# EAGLE schematic wfipic32host (EAGLE 9.6.2)
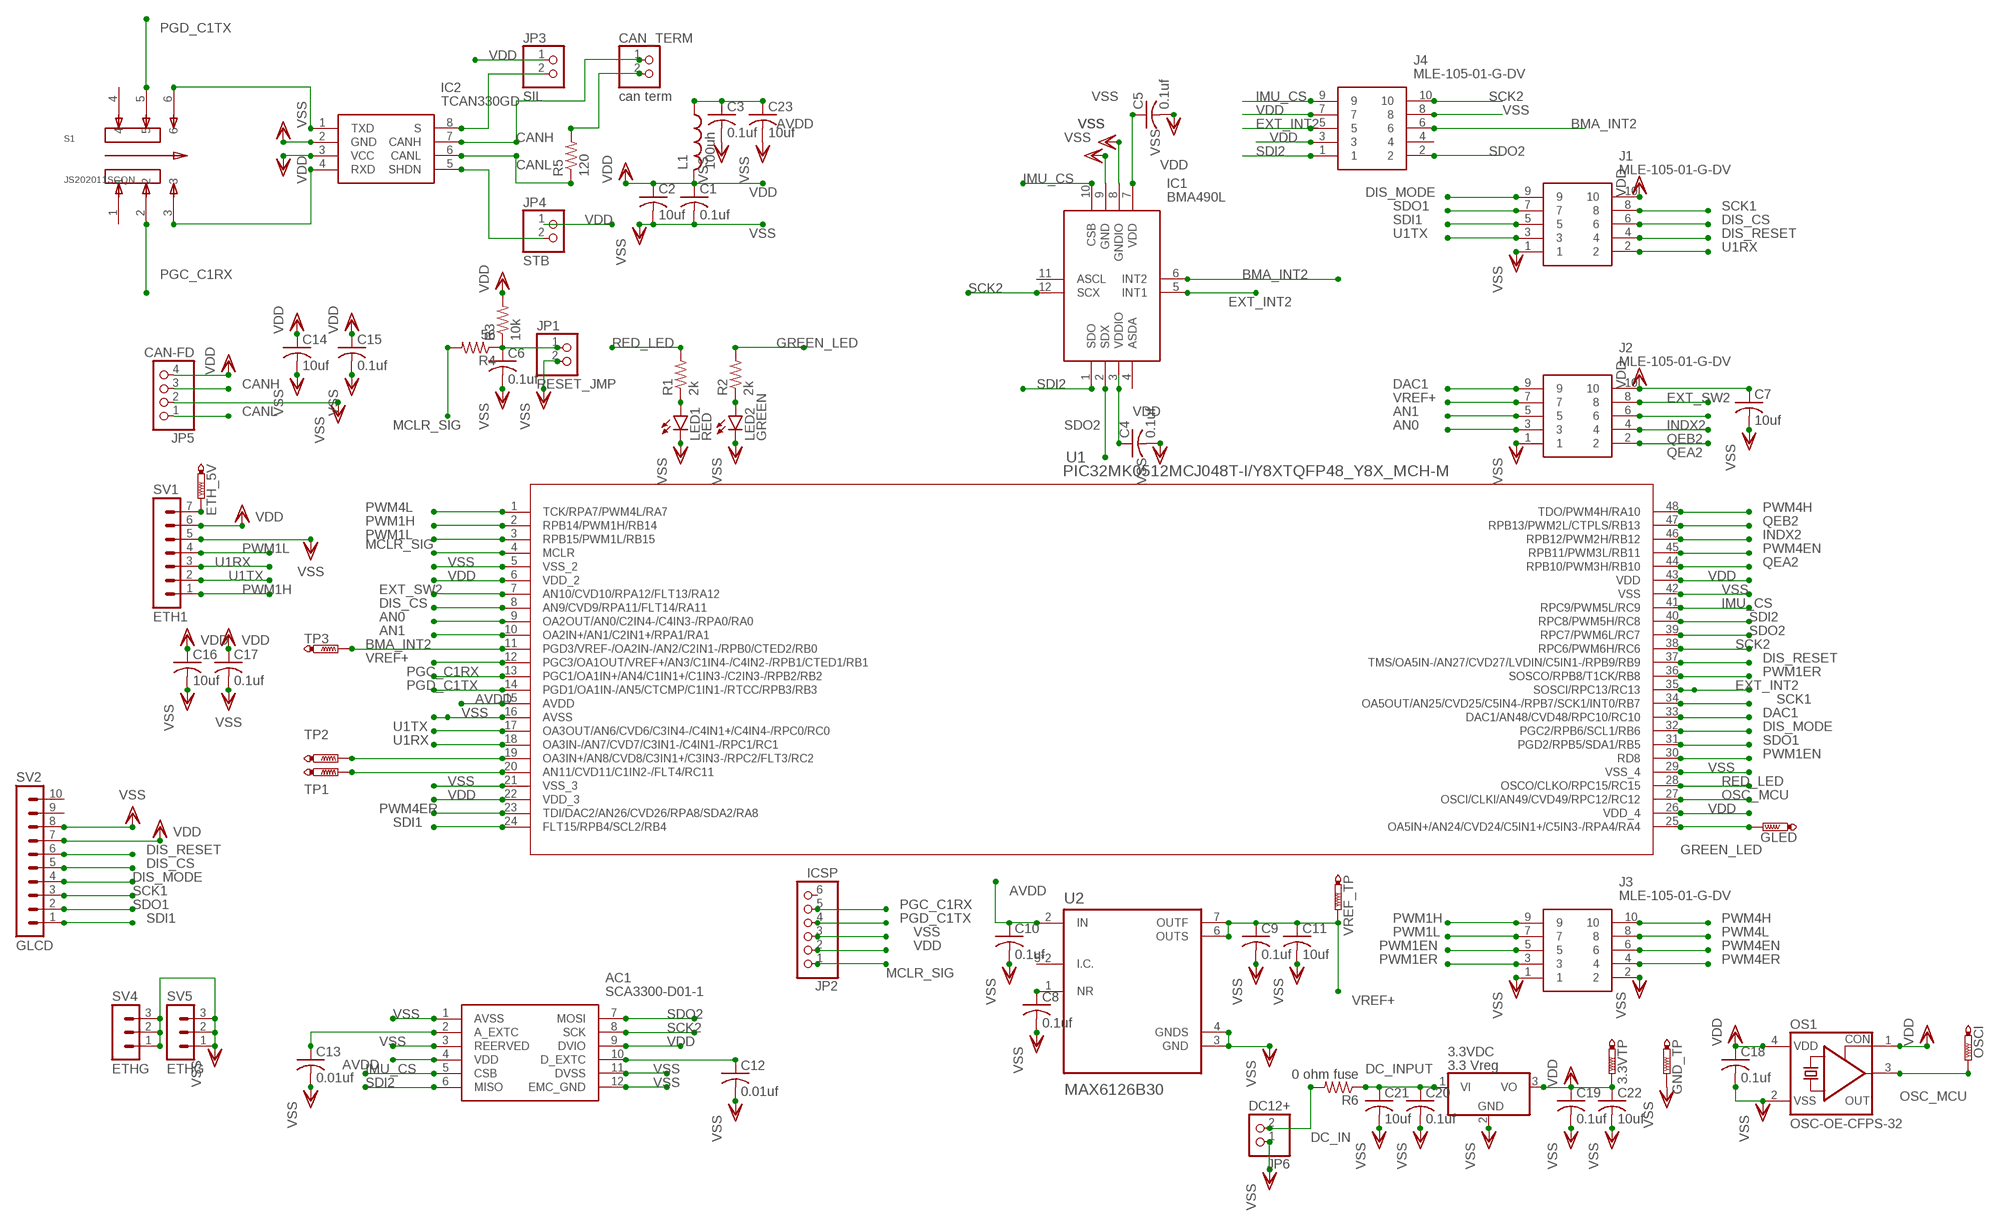
[diagram p0: schematic, sheet 1]

## Parts
3.3VDC  3.3 Vreg  7805TV  [TO220V]
3.3VTP  PTR1PAD1-13  [P1-13]
AC1  SCA3300-D01-1  [SCA3300]
C1  0.1uf  C-USC0805  [C0805]
C2  10uf  C-USC0805  [C0805]
C3  0.1uf  C-USC0805  [C0805]
C4  0.1uf  C-USC0805  [C0805]
C5  0.1uf  C-USC0805  [C0805]
C6  0.1uf  C-USC0805  [C0805]
C7  10uf  C-USC0805  [C0805]
C8  0.1uf  C-USC0805  [C0805]
C9  0.1uf  C-USC0805  [C0805]
C10  0.1uf  C-USC0805  [C0805]
C11  10uf  C-USC0805  [C0805]
C12  0.01uf  C-USC0805  [C0805]
C13  0.01uf  C-USC0805  [C0805]
C14  10uf  C-USC0805  [C0805]
C15  0.1uf  C-USC0805  [C0805]
C16  10uf  C-USC0805  [C0805]
C17  0.1uf  C-USC0805  [C0805]
C18  0.1uf  C-USC0805  [C0805]
C19  0.1uf  C-USC0805  [C0805]
C20  0.1uf  C-USC0805  [C0805]
C21  10uf  C-USC0805  [C0805]
C22  10uf  C-USC0805  [C0805]
C23  10uf  C-USC0805  [C0805]
CAN_TERM  can term  PINHD-1X2  [1X02]
ETH_5V  PTR1PAD1-13  [P1-13]
GLED  PTR1PAD1-13  [P1-13]
GND_TP  PTR1PAD1-13  [P1-13]
IC1  BMA490L  [BMA490L]
IC2  TCAN330GD  [SOIC127P600X175-8N]
J1  MLE-105-01-G-DV  [MLE-105-01-G-DV]
J2  MLE-105-01-G-DV  [MLE-105-01-G-DV]
J3  MLE-105-01-G-DV  [MLE-105-01-G-DV]
J4  MLE-105-01-G-DV  [MLE-105-01-G-DV]
JP1  RESET_JMP  PINHD-1X2  [1X02]
JP2  ICSP  PINHD-1X6  [1X06]
JP3  SIL  PINHD-1X2  [1X02]
JP4  STB  PINHD-1X2  [1X02]
JP5  CAN-FD  PINHD-1X4/90  [1X04/90]
JP6  DC12+  PINHD-1X2  [1X02]
L1  100uh  L-USL3216C  [L3216C]
LED1  RED  LEDCHIPLED_0603  [CHIPLED_0603]
LED2  GREEN  LEDCHIPLED_0603  [CHIPLED_0603]
OS1  OSC-OE-CFPS-32  [7.2X5.2-4-PAD]
OSCI  PTR1PAD1-13  [P1-13]
R1  2k  R-US_M0805  [M0805]
R2  2k  R-US_M0805  [M0805]
R3  10k  R-US_M0805  [M0805]
R4  56  R-US_M0805  [M0805]
R5  120  R-US_M0805  [M0805]
R6  0 ohm fuse  R-US_M1206  [M1206]
S1  JS202011SCQN  [SW_JS202011SCQN]
SV1  ETH1  MA07-1  [MA07-1]
SV2  GLCD  MA10-1  [MA10-1]
SV4  ETHG  MA03-1  [MA03-1]
SV5  ETHG  MA03-1  [MA03-1]
TP1  PTR1PAD1-13  [P1-13]
TP2  PTR1PAD1-13  [P1-13]
TP3  PTR1PAD1-13  [P1-13]
U1  PIC32MK0512MCJ048T-I/Y8XTQFP48_Y8X_MCH-M  [TQFP48_Y8X_MCH-M]
U2  MAX6126B30  [SOP65P490X110-8N]
VREF_TP  PTR1PAD1-13  [P1-13]

## Nets
AN0: J2.3 U1.9(OA2OUT/AN0/C2IN4-/C4IN3-/RPA0/RA0)
AN1: J2.5 U1.10(OA2IN+/AN1/C2IN1+/RPA1/RA1)
AVDD [ncurrent]: AC1.4(VDD) C3.1 C10.1 C23.1 L1.1 U1.15(AVDD) U2.2(IN)
BMA_INT2: IC1.6(INT2) J4.6 TP3.TP U1.11(PGD3/VREF-/OA2IN-/AN2/C2IN1-/RPB0/CTED2/RB0)
CANH: CAN_TERM.1 IC2.7(CANH) JP5.3
CANL: IC2.6(CANL) JP5.1 R5.1
DAC1: J2.9 U1.33(DAC1/AN48/CVD48/RPC10/RC10)
DC_IN [icurrent]: JP6.2 R6.2
DC_INPUT [icurrent]: 3.3VDC.1(VI) C20.1 C21.1 R6.1
DIS_CS: J1.6 SV2.5 U1.8(AN9/CVD9/RPA11/FLT14/RA11)
DIS_MODE: J1.9 SV2.4 U1.32(PGC2/RPB6/SCL1/RB6)
DIS_RESET: J1.4 SV2.6 U1.37(TMS/OA5IN-/AN27/CVD27/LVDIN/C5IN1-/RPB9/RB9)
EXT_INT2: IC1.5(INT1) J4.5 U1.35(SOSCI/RPC13/RC13)
EXT_SW2: J2.8 U1.7(AN10/CVD10/RPA12/FLT13/RA12)
GREEN_LED: GLED.TP R2.2 U1.25(OA5IN+/AN24/CVD24/C5IN1+/C5IN3-/RPA4/RA4)
IMU_CS: AC1.5(CSB) IC1.10(CSB) J4.9 U1.41(RPC9/PWM5L/RC9)
INDX2: J2.6 U1.46(RPB12/PWM2H/RB12)
MCLR_SIG: JP2.1 R4.2 U1.4(MCLR)
N$1: LED1.A R1.1
N$2: LED2.A R2.1
N$3: C6.1 JP1.1 R3.1 R4.1
N$4: C8.1 U2.1(NR)
N$5: TP1.TP U1.20(AN11/CVD11/C1IN2-/FLT4/RC11)
N$6: TP2.TP U1.19(OA3IN+/AN8/CVD8/C3IN1+/C3IN3-/RPC2/FLT3/RC2)
N$7: AC1.10(D_EXTC) C12.1
N$8: ETH_5V.TP SV1.7
N$9: AC1.2(A_EXTC) C13.1
N$10: IC2.1(TXD) S1.6
N$11: IC2.4(RXD) S1.3
N$12: IC2.5(SHDN) JP4.2
N$13: IC2.8(S) JP3.2
N$15: CAN_TERM.2 R5.2
OSC_MCU: OS1.3(OUT) OSCI.TP U1.27(OSCI/CLKI/AN49/CVD49/RPC12/RC12)
PGC_C1RX: JP2.5 S1.2 U1.13(PGC1/OA1IN+/AN4/C1IN1+/C1IN3-/C2IN3-/RPB2/RB2)
PGD_C1TX: JP2.4 S1.5 U1.14(PGD1/OA1IN-/AN5/CTCMP/C1IN1-/RTCC/RPB3/RB3)
PWM1EN: J3.5 U1.30(RD8)
PWM1ER: J3.3 U1.36(SOSCO/RPB8/T1CK/RB8)
PWM1H: J3.9 SV1.1 U1.2(RPB14/PWM1H/RB14)
PWM1L: J3.7 SV1.4 U1.3(RPB15/PWM1L/RB15)
PWM4EN: J3.6 U1.45(RPB11/PWM3L/RB11)
PWM4ER: J3.4 U1.23(TDI/DAC2/AN26/CVD26/RPA8/SDA2/RA8)
PWM4H: J3.10 U1.48(TDO/PWM4H/RA10)
PWM4L: J3.8 U1.1(TCK/RPA7/PWM4L/RA7)
QEA2: J2.2 U1.44(RPB10/PWM3H/RB10)
QEB2: J2.4 U1.47(RPB13/PWM2L/CTPLS/RB13)
RED_LED: R1.2 U1.28(OSCO/CLKO/RPC15/RC15)
SCK1: J1.8 SV2.3 U1.34(OA5OUT/AN25/CVD25/C5IN4-/RPB7/SCK1/INT0/RB7)
SCK2: AC1.8(SCK) IC1.12(SCX) J4.10 U1.38(RPC6/PWM6H/RC6)
SDI1: J1.5 SV2.1 U1.24(FLT15/RPB4/SCL2/RB4)
SDI2: AC1.6(MISO) IC1.1(SDO) J4.1 U1.40(RPC8/PWM5H/RC8)
SDO1: J1.7 SV2.2 U1.31(PGD2/RPB5/SDA1/RB5)
SDO2: AC1.7(MOSI) IC1.2(SDX) J4.2 U1.39(RPC7/PWM6L/RC7)
U1RX: J1.2 SV1.3 U1.18(OA3IN-/AN7/CVD7/C3IN1-/C4IN1-/RPC1/RC1)
U1TX: J1.3 SV1.2 U1.17(OA3OUT/AN6/CVD6/C3IN4-/C4IN1+/C4IN4-/RPC0/RC0)
VDD [ncurrent]: 3.3VDC.3(VO) 3.3VTP.TP AC1.9(DVIO) C1.1 C2.1 C4.1 C5.1 C7.1 C14.1 C15.1 C16.1 C17.1 C18.1 C19.1 C22.1 IC1.3(VDDIO) IC1.7(VDD) IC2.3(VCC) J1.10 J2.10 J4.3 J4.7 JP2.2 JP3.1 JP4.1 JP5.4 L1.2 OS1.1(CON) OS1.4(VDD) R3.2 SV1.6 SV2.7 U1.6(VDD_2) U1.22(VDD_3) U1.26(VDD_4) U1.43(VDD)
VREF+: C9.1 C11.1 J2.7 U1.12(PGC3/OA1OUT/VREF+/AN3/C1IN4-/C4IN2-/RPB1/CTED1/RB1) U2.6(OUTS) U2.7(OUTF) VREF_TP.TP
VSS [ncurrent]: 3.3VDC.2(GND) AC1.1(AVSS) AC1.3(REERVED) AC1.11(DVSS) AC1.12(EMC_GND) C1.2 C2.2 C3.2 C4.2 C5.2 C6.2 C7.2 C8.2 C9.2 C10.2 C11.2 C12.2 C13.2 C14.2 C15.2 C16.2 C17.2 C18.2 C19.2 C20.2 C21.2 C22.2 C23.2 GND_TP.TP IC1.8(GNDIO) IC1.9(GND) IC2.2(GND) J1.1 J2.1 J3.1 J3.2 J4.8 JP1.2 JP2.3 JP5.2 JP6.1 LED1.C LED2.C OS1.2(VSS) SV1.5 SV2.8 SV4.1 SV4.2 SV4.3 SV5.1 SV5.2 SV5.3 U1.5(VSS_2) U1.16(AVSS) U1.21(VSS_3) U1.29(VSS_4) U1.42(VSS) U2.3(GND) U2.4(GNDS)
Unconnected: IC1.4(ASDA) IC1.11(ASCL) J4.4 JP2.6 S1.1 S1.4 SV2.9 SV2.10 U2.5(I.C.) U2.8(I.C.)

## Library data of the parts
3.3VDC = linear:78*: Positive VOLTAGE REGULATOR Source: http://cache.national.com/ds/LM/LM78L05.pdf http://www.fairchildsemi.com/ds/LM/LM7805.pdf
3.3VTP ETH_5V GLED GND_TP OSCI TP1-TP3 VREF_TP = testpad:PTR1: TEST PIN
AC1 = SCA3300-D01-1:SCA3300-D01-1: Murata SCA3300-D01-1, 3-Axis Accelerometer, +/-1.5 +/-6g, 3 3.6 V, SPI, DFL/SMD 12-Pin Source: Datasheet <https://www.murata.com/~/media/webrenewal/products/sensor/accel/sca3300/sca3300-d01 industrial 3-axis accelerometer datasheet _a1.ashx> Check availability <https://pricing.snapeda.com/parts/SCA3300-D01-1/Murata%20Electronics/view-part?ref=eda>; AVAILABILITY: In Stock; DESCRIPTION: Accelerometer X, Y, Z Axis ±1.5g, 3g, 6g - -; MF: Murata Electronics; MP: SCA3300-D01-1; PACKAGE: Nonstandard Murata; PRICE: None; PURCHASE-URL: https://pricing.snapeda.com/search/part/SCA3300-D01-1/?ref=eda
C1-C23 = rcl:C-US: CAPACITOR, American symbol; SPICEPREFIX: C
CAN_TERM JP1 JP3 JP4 JP6 = pinhead:PINHD-1X2: PIN HEADER
IC1 = SamacSys_Parts:BMA490L: Accelerometers High-performance longevity acceleration sensor Source: Datasheet <https://www.mouser.es/datasheet/2/783/bst-bma490l-ds000-1878796.pdf>; DESCRIPTION: Accelerometers High-performance longevity acceleration sensor; HEIGHT: 1mm; MANUFACTURER_NAME: Bosch Sensortec; MANUFACTURER_PART_NUMBER: BMA490L; MOUSER_PART_NUMBER: 262-BMA490L; MOUSER_PRICE-STOCK: https://www.mouser.co.uk/ProductDetail/Bosch-Sensortec/BMA490L?qs=7MVldsJ5UawjTpioRTbJPQ%3D%3D
IC2 = TCAN330GD:TCAN330GD: 3.3-V CAN Transceivers with CAN FD (Flexible Data Rate) Source: Datasheet <http://www.ti.com/lit/gpn/tcan330g>; DESCRIPTION: 3.3-V CAN Transceivers with CAN FD (Flexible Data Rate); HEIGHT: 1.75mm; MANUFACTURER_NAME: Texas Instruments; MANUFACTURER_PART_NUMBER: TCAN330GD; MOUSER_PART_NUMBER: 595-TCAN330GD; MOUSER_PRICE-STOCK: https://www.mouser.co.uk/ProductDetail/Texas-Instruments/TCAN330GD?qs=9DwIlvx97ae6H3qgocd9Aw%3D%3D
J1-J4 = MLE-105-01-G-DV:MLE-105-01-G-DV: 10 Position, 1.00 mm Tiger Beam™ Cost-Effective Single Beam Socket Strip Source: Datasheet <http://suddendocs.samtec.com/prints/mle-1xx-xx-x-dv-x-mkt1.pdf>; DESCRIPTION: 10 Position, 1.00 mm Tiger Beam&trade; Cost-Effective Single Beam Socket Strip; HEIGHT: mm; MANUFACTURER_NAME: SAMTEC; MANUFACTURER_PART_NUMBER: MLE-105-01-G-DV; MOUSER_PART_NUMBER: 200-MLE10501GDV; MOUSER_PRICE-STOCK: https://www.mouser.co.uk/ProductDetail/Samtec/MLE-105-01-G-DV?qs=rU5fayqh%252BE2dXiDvl4XeQQ%3D%3D
JP2 = pinhead:PINHD-1X6: PIN HEADER
JP5 = pinhead:PINHD-1X4: PIN HEADER
L1 = rcl:L-US: INDUCTOR, American symbol; SPICEPREFIX: L
LED1 LED2 = led:LED: LED OSRAM: - CHIPLED LG R971, LG N971, LY N971, LG Q971, LY Q971, LO R971, LY R971 LH N974, LH R974 LS Q976, LO Q976, LY Q976 LO Q996 - Hyper CHIPLED LW Q18S LB Q993, LB Q99A, LB R99A - SideLED LS A670, LO A670, LY A670, LG A670, LP A670 LB A673, LV A673, LT A673, LW A673 LH A674 LY A675 LS A676, LA A676, LO A676, LY A676, LW A676 LS A679, LY A679, LG A679 - Hyper Micro SIDELED® LS Y876, LA Y876, LO Y876, LY Y876 LT Y87S - SmartLED LW L88C, LW L88S LB L89C, LB L89S, LG L890 LS L89K, LO L89K, LY L89K LS L896, LA L896, LO L896, LY L896 - TOPLED LS T670, LO T670, LY T670, LG T670, LP T670 LSG T670, LSP T670, LSY T670, LOP T670, LYG T670 LG T671, LOG T671, LSG T671 LB T673, LV T673, LT T673, LW T673 LH T674 LS T676, LA T676, LO T676, LY T676, LB T676, LH T676, LSB T676, LW T676 LB T67C, LV T67C, LT T67C, LS T67K, LO T67K, LY T67K, LW E67C LS E67B, LA E67B, LO E67B, LY E67B, LB E67C, LV E67C, LT E67C LW T67C LS T679, LY T679, LG T679 LS T770, LO T770, LY T770, LG T770, LP T770 LB T773, LV T773, LT T773, LW T773 LH T774 LS E675, LA E675, LY E675, LS T675 LS T776, LA T776, LO T776, LY T776, LB T776 LHGB T686 LT T68C, LB T68C - Hyper Mini TOPLED® LB M676 - Mini TOPLED Santana® LG M470 LS M47K, LO M47K, LY M47K Source: http://www.osram.convergy.de LUXEON: - LUMILED® LXK2-PW12-R00, LXK2-PW12-S00, LXK2-PW14-U00, LXK2-PW14-V00 LXK2-PM12-R00, LXK2-PM12-S00, LXK2-PM14-U00 LXK2-PE12-Q00, LXK2-PE12-R00, LXK2-PE12-S00, LXK2-PE14-T00, LXK2-PE14-U00 LXK2-PB12-K00, LXK2-PB12-L00, LXK2-PB12-M00, LXK2-PB14-N00, LXK2-PB14-P00, LXK2-PB14-Q00 LXK2-PR12-L00, LXK2-PR12-M00, LXK2-PR14-Q00, LXK2-PR14-R00 LXK2-PD12-Q00, LXK2-PD12-R00, LXK2-PD12-S00 LXK2-PH12-R00, LXK2-PH12-S00 LXK2-PL12-P00, LXK2-PL12-Q00, LXK2-PL12-R00 Source: www.luxeon.com KINGBRIGHT: KA-3528ASYC Source: www.kingbright.com
OS1 = IQD-Frequency-Products:OSC-OE: OSCILLATOR WITH OE
R1-R6 = rcl:R-US_: RESISTOR, American symbol; SPICEPREFIX: R
S1 = JS202011SCQN_fixed:JS202011SCQN: JS Series DPDT On-On Gull Wing Surface Mount Subminiature Slide Switch; AVAILABILITY: Unavailable; DESCRIPTION: JS Series DPDT On-On Gull Wing Surface Mount Subminiature Slide Switch; MF: C&K; MP: JS202011SCQN; PACKAGE: None; PRICE: None
SV1 = con-lstb:MA07-1: PIN HEADER; OC_FARNELL: unknown; OC_NEWARK: unknown
SV2 = con-lstb:MA10-1: PIN HEADER; OC_FARNELL: unknown; OC_NEWARK: unknown
SV4 SV5 = con-lstb:MA03-1: PIN HEADER; OC_FARNELL: unknown; OC_NEWARK: unknown
U1 = 2022-08-07_22-50-41_Library:PIC32MK0512MCJ048T-I/Y8X; COPYRIGHT: Copyright (C) 2022 Ultra Librarian. All rights reserved.; MANUFACTURER_PART_NUMBER: PIC32MK0512MCJ048T-I/Y8X; MFR_NAME: Microchip
U2 = MAX6126B30:MAX6126B30; DESCRIPTION: Series Voltage Reference IC Fixed 3V V ±0.1% 10 mA 8-uMAX-EP|8-uSOP-EP; DIGI-KEY_PART_NUMBER: MAX6126B30+T-ND; MF: Maxim Integrated; MP: MAX6126B30+T; PACKAGE: MICRO MAX-8 Maxim; PURCHASE-URL: https://pricing.snapeda.com/search/part/MAX6126B30+T/?ref=eda

## Net classes
1 icurrent: width 0.305 mm
2 ncurrent: width 0.203 mm